# Altium schematic sheet Dust1_MotherBoard_PWR.SchDoc
size A3; SheetNumber: 3; SheetTotal: 5
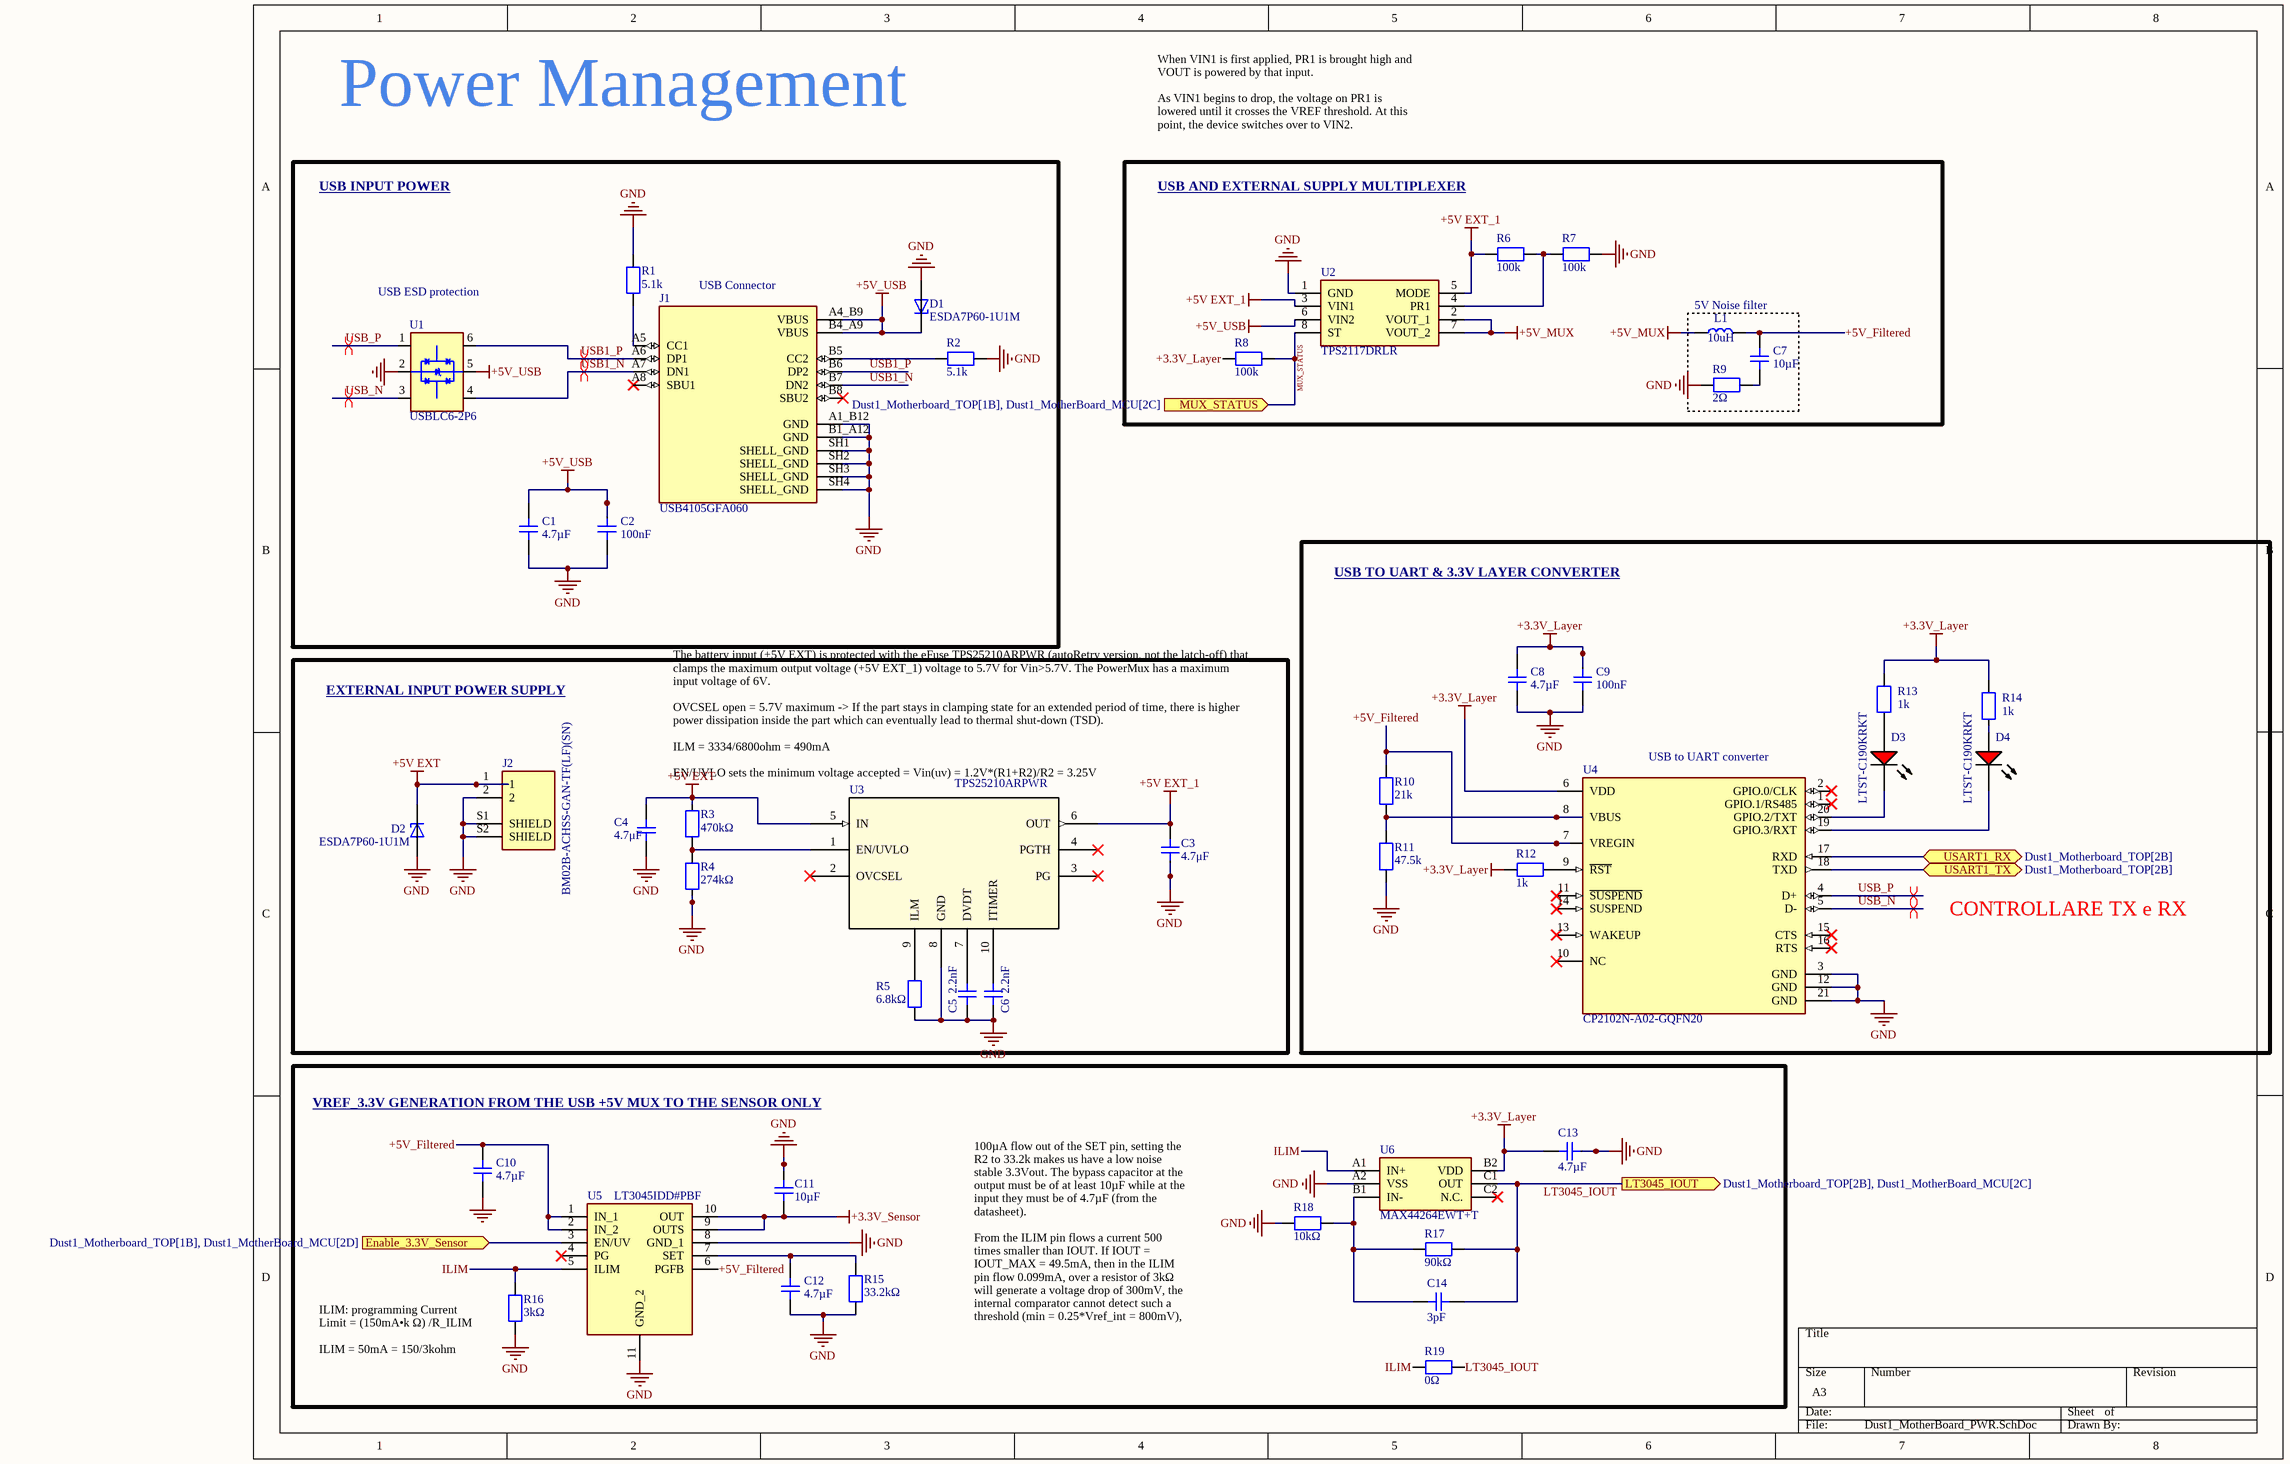
[diagram p0: Dust1_MotherBoard_PWR.SchDoc]

## Parts
C1  4.7µF  [CAP_0603]
C2  100nF  [CAP_0603]
C3  4.7μF  [CAP_0603]
C4  4.7μF  [CAP_0603]
C5  2.2nF  [CAP_0402]
C6  2.2nF  [CAP_0402]
C7  10µF  [CAP_0603]
C8  4.7µF  [CAP_0603]
C9  100nF  [CAP_0603]
C10  4.7µF  [CAP_0603]
C11  10µF  [CAP_0603]
C12  4.7µF  [CAP_0603]
C13  4.7µF  [CAP_0603]
C14  3pF  [CAP_0402]
D1  ESDA7P60-1U1M  [TVS_ESDA7P60-1U1M]
D2  ESDA7P60-1U1M  [TVS_ESDA7P60-1U1M]
D3  LTST-C190KRKT  [LTST-C191KRKT_V]
D4  LTST-C190KRKT  [LTST-C191KRKT_V]
J1  USB4105GFA060  [GCT_USB4105GFA060]
J2  BM02B-ACHSS-GAN-TF(LF)(SN)  [JST_BM02B-ACHSS-GAN-TF(LF)(SN)]
L1  10uH  [IND_0603]
R1  5.1k  [RES_0603]
R2  5.1k  [RES_0603]
R3  470kΩ  [RES_0603]
R4  274kΩ  [RES_0603]
R5  6.8kΩ  [RES_0603]
R6  100k  [RES_0402]
R7  100k  [RES_0402]
R8  100k  [RES_0402]
R9  2Ω  [RES_0603]
R10  21k  [RES_0603]
R11  47.5k  [RES_0603]
R12  1k  [RES_0402]
R13  1k  [RES_0402]
R14  1k  [RES_0402]
R15  33.2kΩ  [RES_0402]
R16  3kΩ  [RES_0402]
R17  90kΩ  [RES_0402]
R18  10kΩ  [RES_0402]
R19  0Ω  [RES_0603]
U1  USBLC6-2P6  [SOT50P160X60-6N]
U2  TPS2117DRLR  [SOTFL50P160X60-8N]
U3  TPS25210ARPWR  [TPS259460ARPWR_TEX]
U4  CP2102N-A02-GQFN20  [FP-CP2102N-A02-GQFN20-MFG]
U5  LT3045IDD#PBF  [SON50P300X300X80-11N-D]
U6  MAX44264EWT+T  [BGA6C40P2X3_91X131X69]

## Blocks framed on the sheet
USB INPUT POWER: C1 C2 D1 J1 R1 R2 U1
USB AND EXTERNAL SUPPLY MULTIPLEXER: R6-R8 U2
5V Noise filter: C7 L1 R9
CONTROLLARE TX e RX: C8 C9 D3 D4 R10-R14 U4
EXTERNAL INPUT POWER SUPPLY: C3-C6 D2 J2 R3-R5 U3
VREF_3.3V GENERATION FROM THE USB +5V MUX TO THE SENSOR ONLY: C10-C14 R15-R19 U5 U6

## Ports
Enable_3.3V_Sensor (in, see Dust1_Motherboard_TOP[1B], Dust1_MotherBoard_MCU[2D]), LT3045_IOUT (out, see Dust1_Motherboard_TOP[2B], Dust1_MotherBoard_MCU[2C]), MUX_STATUS (in, see Dust1_Motherboard_TOP[1B], Dust1_MotherBoard_MCU[2C]), USART1_RX (bidir, see Dust1_Motherboard_TOP[2B]), USART1_TX (bidir, see Dust1_Motherboard_TOP[2B])

## Nets
+3.3V_Layer: C8.2 C9.2 C13.2 R8.2 R12.2 R13.2 R14.2 U4.6(VDD) U6.B2(VDD)
+3.3V_Sensor: C11.1 U5.9(OUTS) U5.10(OUT)
+5V EXT: C4.2 D2.1 J2.1 R3.1 U3.5(IN)
+5V EXT_1: C3.2 R6.1 U2.3(VIN1) U2.5(MODE) U3.6(OUT)
+5V_MUX: L1.1 U2.2(VOUT_1) U2.7(VOUT_2)
+5V_USB: C1.2 C2.2 D1.1 J1.A4_B9(VBUS) J1.B4_A9(VBUS) U1.5(VBUS) U2.6(VIN2)
GND: C1.1 C2.1 C3.1 C4.1 C5.2 C6.2 C8.1 C9.1 C10.1 C11.2 C12.1 C13.1 D1.2 D2.2 J1.A1_B12(GND) J1.B1_A12(GND) J1.SH1(SHELL_GND) J1.SH2(SHELL_GND) J1.SH3(SHELL_GND) J1.SH4(SHELL_GND) J2.2 J2.S1(SHIELD) J2.S2(SHIELD) R1.2 R2.1 R4.2 R5.2 R7.2 R9.1 R11.2 R15.2 R16.2 R18.2 U1.2(GND) U2.1(GND) U3.8(GND) U4.3(GND) U4.12(GND) U4.21(GND) U5.8(GND_1) U5.11(GND_2) U6.A2(VSS)
+5V_Filtered: C7.2 C10.2 L1.2 R10.1 U4.7(VREGIN) U5.1(IN_1) U5.2(IN_2) U5.6(PGFB)
Enable_3.3V_Sensor: U5.3(EN/UV) ; port Enable_3.3V_Sensor
ILIM: R16.1 R19.1 U5.5(ILIM) U6.A1(IN+)
LT3045_IOUT: C14.2 R17.1 R19.2 U6.C1(OUT) ; port LT3045_IOUT
MUX_STATUS: R8.1 U2.8(ST) ; port MUX_STATUS
USART1_RX: U4.17(RXD) ; port USART1_RX
USART1_TX: U4.18(TXD) ; port USART1_TX
USB1_N: J1.A7(DN1) J1.B7(DN2) U1.4(I/O2_2)
USB1_P: J1.A6(DP1) J1.B6(DP2) U1.6(I/O1_2)
USB_N: U1.3(I/O2_1) U4.5(D-)
USB_P: U1.1(I/O1_1) U4.4(D+)
NetC5_1: C5.1 U3.7(DVDT)
NetC6_1: C6.1 U3.10(ITIMER)
NetC7_1: C7.1 R9.2
NetC12_2: C12.2 R15.1 U5.7(SET)
NetC14_1: C14.1 R17.2 R18.1 U6.B1(IN-)
NetD3_1: D3.1(A) R13.1
NetD3_2: D3.2(K) U4.20(GPIO.2/TXT)
NetD4_1: D4.1(A) R14.1
NetD4_2: D4.2(K) U4.19(GPIO.3/RXT)
NetJ1_A5: J1.A5(CC1) R1.1
NetJ1_B5: J1.B5(CC2) R2.2
NetR3_2: R3.2 R4.1 U3.1(EN/UVLO)
NetR5_1: R5.1 U3.9(ILM)
NetR6_2: R6.2 R7.1 U2.4(PR1)
NetR10_2: R10.2 R11.1 U4.8(VBUS)
NetR12_1: R12.1 U4.9(~{RST})

Not connected (* = marked no-connect by the designer): J1 A8(SBU1)* B8(SBU2)*; U3 2(OVCSEL)* 3(PG)* 4(PGTH)*; U4 1(GPIO.1/RS485)* 2(GPIO.0/CLK)* 10(NC)* 11(~{SUSPEND})* 13(WAKEUP)* 14(SUSPEND)* 15(CTS)* 16(RTS)*; U5 4(PG)*; U6 C2(N.C.)*

## Layout directives
differential pair: USB1_N, USB1_P, USB_N, USB_P

## Notes on the sheet
- Power Management
- When VIN1 is first applied, PR1 is brought high and VOUT is powered by that input.
  As VIN1 begins to drop, the voltage on PR1 is lowered until it crosses the VREF threshold. At this point, the device switches over to VIN2.
- (near U1) USB ESD protection
- (near J1) USB Connector
- USB TO UART & 3.3V LAYER CONVERTER
- (near U4) USB to UART converter
- The battery input (+5V EXT) is protected with the eFuse TPS25210ARPWR (autoRetry version, not the latch-off) that clamps the maximum output voltage (+5V EXT_1) voltage to 5.7V for Vin>5.7V. The PowerMux has a maximum input voltage of 6V.
  OVCSEL open = 5.7V maximum -> If the part stays in clamping state for an extended period of time, there is higher power dissipation inside the part which can eventually lead to thermal shut-down (TSD).
  ILM = 3334/6800ohm = 490mA
  EN/UVLO sets the minimum voltage accepted = Vin(uv) = 1.2V*(R1+R2)/R2 = 3.25V
- (near R16) ILIM: programming Current Limit = (150mA•k Ω) /R_ILIM
  ILIM = 50mA = 150/3kohm
- 100µA flow out of the SET pin, setting the R2 to 33.2k makes us have a low noise stable 3.3Vout. The bypass capacitor at the output must be of at least 10µF while at the input they must be of 4.7µF (from the datasheet).
  From the ILIM pin flows a current 500 times smaller than IOUT. If IOUT = IOUT_MAX = 49.5mA, then in the ILIM pin flow 0.099mA, over a resistor of 3kΩ will generate a voltage drop of 300mV, the internal comparator cannot detect such a threshold (min = 0.25*Vref_int = 800mV), gain x10 needed.

## Library data of the parts
C1-C4 C7-C13 = CMP-001-00100-1: Source: CAP_0603.SchLib; Design Item ID: CAP_0603
C5 C6 C14 = CMP-001-00099-2: Generic 0402 Capacitor; Design Item ID: CAP_0402; Source: CAP_0402.SchLib
D1 D2 = CMP-004-00038-2: MF: {'manufacturer': u'STMicroelectronics'}; Price: None; Value: *; Pins: 2; Availability: Unavailable; Component Type: Standard; MP: ESDA7P60-1U1M; Design Item ID: ESDA7P60-1U1M; Case/Package: None; Source: ESDA7P60-1U1M.SchLib
D3 D4 = CMP-007-00024-2: LED Uni-Color Red, 62.5 mW, 25 mA, -30 to 85 degC, 2-Pin SMD, RoHS, Tape and Reel; Manufacturer: Lite-On; Luminous Intensity: 54mcd; Lens Style: Diffused; Forward Voltage: 2V; Power: 75mW; Viewing Angle: 130degrees; Forward Current: 20mA; Mounting Technology: SM; Manufacturer URL: http://www.us.liteon.com/; Max Operating Temperature: 85°C; Packaging: TapeandReel; Package Description: 2-Pin Surface Mount Device, Body 1.6 x 0.8 mm; Nominal Vf: 2V; Min Operating Temperature: -55°C; Datasheet Version: Rev. F, 05/2013; RoHS Compliant: True; Illumination Colour: Red; Colour: Red; Pins: 2; Package Reference: C191KRKT; Datasheet URL: http://optoelectronics.liteon.com/upload/download/DS-22-99-0151/S_110_LTST-C190KRKT.pdf; Package Quantity: 3000; Case/Package: 0603
J1 = CMP-002-00087-2: USB-C (USB TYPE-C) USB 2.0 Receptacle Connector 24 (16+8 Dummy) Position Surface Mount, Right Angle; Through Hole; MF: Global Connector Technology; Source: USB4105GFA060.SchLib; MP: USB4105GFA060; Component Type: Standard; Check_prices: https://www.snapeda.com/parts/USB4105GFA060/Global+Connector+Technology/view-part/?ref=eda; Value: *; Design Item ID: USB4105GFA060; Case/Package: None; Pins: 16; SnapEDA_Link: https://www.snapeda.com/parts/USB4105GFA060/Global+Connector+Technology/view-part/?ref=snap
J2 = CMP-002-00091-1: Connector Header Surface Mount, Right Angle 2 position 0.047 (1.20mm); MF: JST Sales; Pins: 4; Value: *; SnapEDA_Link: https://www.snapeda.com/parts/BM02B-ACHSS-GAN-TF(LF)(SN)/JST/view-part/?ref=snap; MP: BM02B-ACHSS-GAN-TF(LF)(SN); Design Item ID: BM02B-ACHSS-GAN-TF(LF)(SN); Check_prices: https://www.snapeda.com/parts/BM02B-ACHSS-GAN-TF(LF)(SN)/JST/view-part/?ref=eda; Source: BM02B-ACHSS-GAN-TF(LF)(SN).SchLib; Case/Package: None; Component Type: Standard
L1 = CMP-006-00026-1: Generic 0603 Inductor; Source: IND_0603.SchLib; Design Item ID: IND_0603
R1-R5 R9-R11 R19 = CMP-009-00186-1: Design Item ID: RES_0603; Source: RES_0603.SchLib
R6-R8 R12-R18 = CMP-009-00192-1: Resistor SMD 0402 Generic; Design Item ID: RES_0402; Source: RES_0402.SchLib
U1 = CMP-004-00037-4: 17V Clamp 5A (8/20Âµs) Ipp Tvs Diode Surface Mount SOT-666; MF: STMicroelectronics; Value: *; Component Type: Standard; Pins: 6; Check_prices: https://www.snapeda.com/parts/USBLC6-2P6/STMicroelectronics/view-part/?ref=eda; SnapEDA_Link: https://www.snapeda.com/parts/USBLC6-2P6/STMicroelectronics/view-part/?ref=snap; Source: USBLC6-2P6.SchLib; Design Item ID: USBLC6-2P6; Case/Package: SOT-666 STMicroelectronics; MP: USBLC6-2P6
U2 = CMP-011-00021-5: Power Switch ICs - Power Distribution 1.6-V to 5.5-V, 20-m?, 4-A low IQ power multiplexer with manual and priority switchover 8-SOT-5X3 -40 to 125; Manufacturer_Name: Texas Instruments; Geometry.Height: 0.6mm; Mouser Part Number: 595-TPS2117DRLR; Mouser Price/Stock: https://www.mouser.co.uk/ProductDetail/Texas-Instruments/TPS2117DRLR?qs=HoCaDK9Nz5c%2FKe5lpCPPWQ%3D%3D; Datasheet Link: https://www.ti.com/lit/ds/symlink/tps2117.pdf?ts=1704705133749&ref_url=https%253A%252F%252Fwww.ti.com%252Fproduct%252FTPS2117; Source: TPS2117DRLR.SchLib; Manufacturer_Part_Number: TPS2117DRLR; Design Item ID: TPS2117DRLR
U3 = CMP-122-000000-5: 2.7-V to 5.7-V, 31-mâ„; Manufacturer_Name: Texas Instruments; RefDes: RefDes; Design Item ID: TPS25210ARPWR; Manufacturer_Part_Number: TPS25210ARPWR; Type: Type; Copyright: Copyright (C) 2025 Ultra Librarian. All rights reserved.; Source: TPS25210ARPWR.SchLib
U4 = CMP-08093-000006-1: IC USB TO UART BRIDGE QFN20
U5 = CMP-111-000001-2: Linear Technology LT3045IDD#PBF, LDO Regulator, 500mA Adjustable, 0  15 V, +/-1% 10-Pin, DFN; Manufacturer_Name: Analog Devices; Geometry.Height: 0.8mm; Manufacturer_Part_Number: LT3045IDD#PBF; Source: LT3045IDD#PBF.SchLib; Datasheet Link: https://www.analog.com/media/en/technical-documentation/data-sheets/3045fa.pdf; Arrow Part Number: LT3045IDD#PBF; Mouser Part Number: 584-LT3045IDD#PBF; Arrow Price/Stock: https://www.arrow.com/en/products/lt3045iddpbf/analog-devices?utm_currency=USD&region=nac; Design Item ID: LT3045IDD#PBF; Mouser Price/Stock: https://www.mouser.co.uk/ProductDetail/Analog-Devices/LT3045IDDPBF?qs=oahfZPh6IAL0HQTYgxXgGA%3D%3D
U6 = CMP-014-00013-4: MAXIM INTEGRATED PRODUCTS - MAX44264EWT+T - Operational Amplifier, RRIO, 1 Amplifier, 9 kHz, 2 V/ms, 1.8V to 5.5V, WLP, 6 Pins; Manufacturer_Name: Analog Devices; Geometry.Height: 0.69mm; Arrow Price/Stock: *; Datasheet Link: http://datasheets.maximintegrated.com/en/ds/MAX44264.pdf; Arrow Part Number: *; Mouser Price/Stock: https://www.mouser.co.uk/ProductDetail/Analog-Devices-Maxim-Integrated/MAX44264EWT%2bT?qs=tT6YvvQkxsyLGbMOGQ483A%3D%3D; Mouser Part Number: 700-MAX44264EWT+T; Design Item ID: MAX44264EWT+T; Manufacturer_Part_Number: MAX44264EWT+T; Source: MAX44264EWT+T.SchLib